# EAGLE schematic ESC v0.2 (EAGLE 9.0.0)
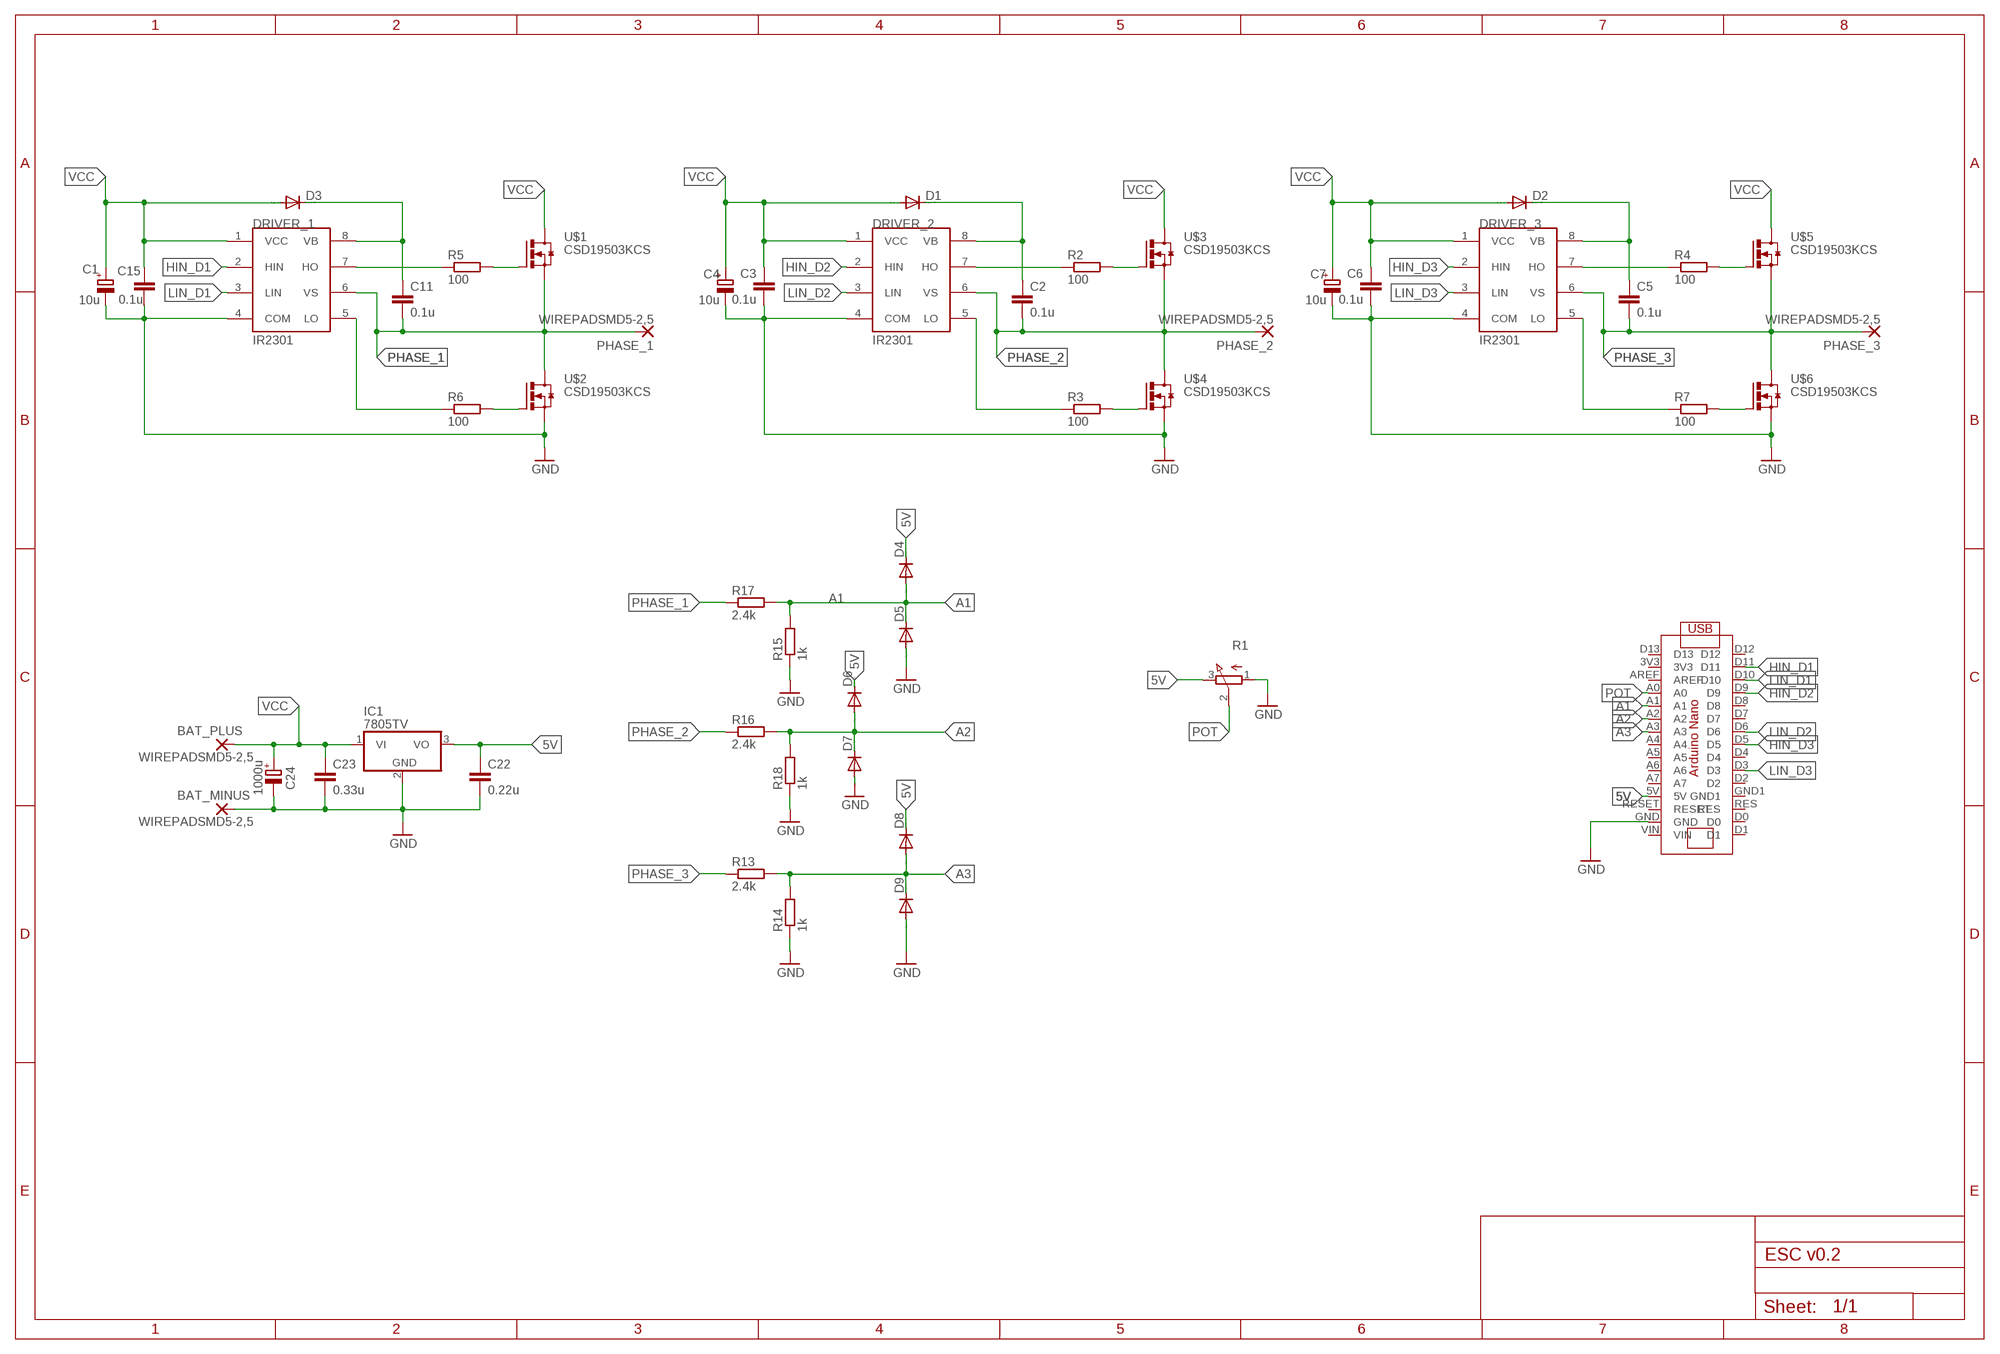
[diagram p0: schematic, sheet 1]

## Parts
BAT_MINUS  WIREPADSMD5-2,5  [5-2,5]
BAT_PLUS  WIREPADSMD5-2,5  [5-2,5]
C1  10u  CPOL-EU153CLV-0605  [153CLV-0605]
C2  0.1u  CC1206  [C1206]
C3  0.1u  CC1206  [C1206]
C4  10u  CPOL-EU153CLV-0605  [153CLV-0605]
C5  0.1u  CC1206  [C1206]
C6  0.1u  CC1206  [C1206]
C7  10u  CPOL-EU153CLV-0605  [153CLV-0605]
C11  0.1u  CC1206  [C1206]
C15  0.1u  CC1206  [C1206]
C22  0.22u  CC1206  [C1206]
C23  0.33u  CC1206  [C1206]
C24  1000u  CPOL-EUE7.5-16  [E7,5-16]
D1  DIODE-DO41-10  [DO41-10]
D2  DIODE-DO41-10  [DO41-10]
D3  DIODE-DO41-10  [DO41-10]
D4  DIODE-DO41-10  [DO41-10]
D5  DIODE-DO41-10  [DO41-10]
D6  DIODE-DO41-10  [DO41-10]
D7  DIODE-DO41-10  [DO41-10]
D8  DIODE-DO41-10  [DO41-10]
D9  DIODE-DO41-10  [DO41-10]
DRIVER_1  IR2301  [DIL08]
DRIVER_2  IR2301  [DIL08]
DRIVER_3  IR2301  [DIL08]
IC1  7805TV  [TO220V]
PHASE_1  WIREPADSMD5-2,5  [5-2,5]
PHASE_2  WIREPADSMD5-2,5  [5-2,5]
PHASE_3  WIREPADSMD5-2,5  [5-2,5]
R1  3RP/1610N  [3RP/1610N]
R2  100  R-EU_R1206  [R1206]
R3  100  R-EU_R1206  [R1206]
R4  100  R-EU_R1206  [R1206]
R5  100  R-EU_R1206  [R1206]
R6  100  R-EU_R1206  [R1206]
R7  100  R-EU_R1206  [R1206]
R13  2.4k  R-EU_R1206  [R1206]
R14  1k  R-EU_R1206  [R1206]
R15  1k  R-EU_R1206  [R1206]
R16  2.4k  R-EU_R1206  [R1206]
R17  2.4k  R-EU_R1206  [R1206]
R18  1k  R-EU_R1206  [R1206]
U$1  CSD19503KCS  [TO220BV]
U$2  CSD19503KCS  [TO220BV]
U$3  CSD19503KCS  [TO220BV]
U$4  CSD19503KCS  [TO220BV]
U$5  CSD19503KCS  [TO220BV]
U$6  CSD19503KCS  [TO220BV]
U$7  ARDUINO-NANO  [ARDUINO-NANO]

## Nets
5V: C22.1 D4.C D6.C D8.C IC1.3(VO) R1.3(E) U$7.5V
A1: D4.A D5.C R15.2 R17.2 U$7.A1
A2: D6.A D7.C R16.2 R18.2 U$7.A2
A3: D8.A D9.C R13.2 R14.2 U$7.A3
GND: BAT_MINUS.1(P) C1.- C3.2 C4.- C6.2 C7.- C15.2 C22.2 C23.2 C24.- D5.A D7.A D9.A DRIVER_1.4(COM) DRIVER_2.4(COM) DRIVER_3.4(COM) IC1.2(GND) R1.1(A) R14.1 R15.1 R18.1 U$2.S U$4.S U$6.S U$7.GND
HIN_D1: DRIVER_1.2(HIN) U$7.D11
HIN_D2: DRIVER_2.2(HIN) U$7.D9
HIN_D3: DRIVER_3.2(HIN) U$7.D5
LIN_D1: DRIVER_1.3(LIN) U$7.D10
LIN_D2: DRIVER_2.3(LIN) U$7.D6
LIN_D3: DRIVER_3.3(LIN) U$7.D3
N$1: DRIVER_2.7(HO) R2.1
N$2: DRIVER_2.5(LO) R3.1
N$3: R2.2 U$3.G
N$4: R3.2 U$4.G
N$5: DRIVER_3.7(HO) R4.1
N$6: DRIVER_3.5(LO) R7.1
N$7: R4.2 U$5.G
N$8: R7.2 U$6.G
N$15: DRIVER_1.7(HO) R5.1
N$18: DRIVER_1.5(LO) R6.1
N$19: R5.2 U$1.G
N$20: R6.2 U$2.G
PHASE_1: C11.2 DRIVER_1.6(VS) PHASE_1.1(P) R17.1 U$1.S U$2.D
PHASE_2: C2.2 DRIVER_2.6(VS) PHASE_2.1(P) R16.1 U$3.S U$4.D
PHASE_3: C5.2 DRIVER_3.6(VS) PHASE_3.1(P) R13.1 U$5.S U$6.D
POT: R1.2(S) U$7.A0
VB: C2.1 C5.1 C11.1 D1.C D2.C D3.C DRIVER_1.8(VB) DRIVER_2.8(VB) DRIVER_3.8(VB)
VCC: BAT_PLUS.1(P) C1.+ C3.1 C4.+ C6.1 C7.+ C15.1 C23.1 C24.+ D1.A D2.A D3.A DRIVER_1.1(VCC) DRIVER_2.1(VCC) DRIVER_3.1(VCC) IC1.1(VI) U$1.D U$3.D U$5.D
Unconnected: U$7.3V3 U$7.A4 U$7.A5 U$7.A6 U$7.A7 U$7.AREF U$7.D0 U$7.D1 U$7.D2 U$7.D4 U$7.D7 U$7.D8 U$7.D12 U$7.D13 U$7.GND1 U$7.RES U$7.RESET U$7.VIN

## Library data of the parts
BAT_MINUS BAT_PLUS PHASE_1-PHASE_3 = wirepad:WIREPAD: Wire PAD connect wire on PCB
C1 C4 C7 C24 = resistor:CPOL-EU: POLARIZED CAPACITOR, European symbol
C2 C3 C5 C6 C11 C15 C22 C23 = Kondensator.:C: KONDENSATOR
D1-D9 = diode:DIODE-: DIODE
DRIVER_1-DRIVER_3 = kirill:IR2301: High and low side driver; AVAILABILITY: Unavailable; DESCRIPTION: High and Low Side Driver, Noninverting Inputs; MF: Infineon; MP: IR2301; PACKAGE: DIP-8 International Rectifier; PRICE: None
IC1 = linear:78*: Positive VOLTAGE REGULATOR Source: http://cache.national.com/ds/LM/LM78L05.pdf http://www.fairchildsemi.com/ds/LM/LM7805.pdf
R1 = pot:3RP/1610N: 16mm Potentiometer one level Source: http://www.alphapotentiometers.net/html/16mm_pot_2.html
R2-R7 R13-R18 = Widerstände:R-EU_: RESISTOR; SPICEPREFIX: R
U$1 = CSD19503KCS:CSD19503KCS: Power Mosfet, Texas Instrument; SPICEPREFIX: M
U$2-U$6 = CSD19503KCS:CSD19503KCS: Power Mosfet, Texas Instrument
U$7 = Arduino-nano:ARDUINO-NANO